# EAGLE design TPT02_tentative (EAGLE 7.7.0)
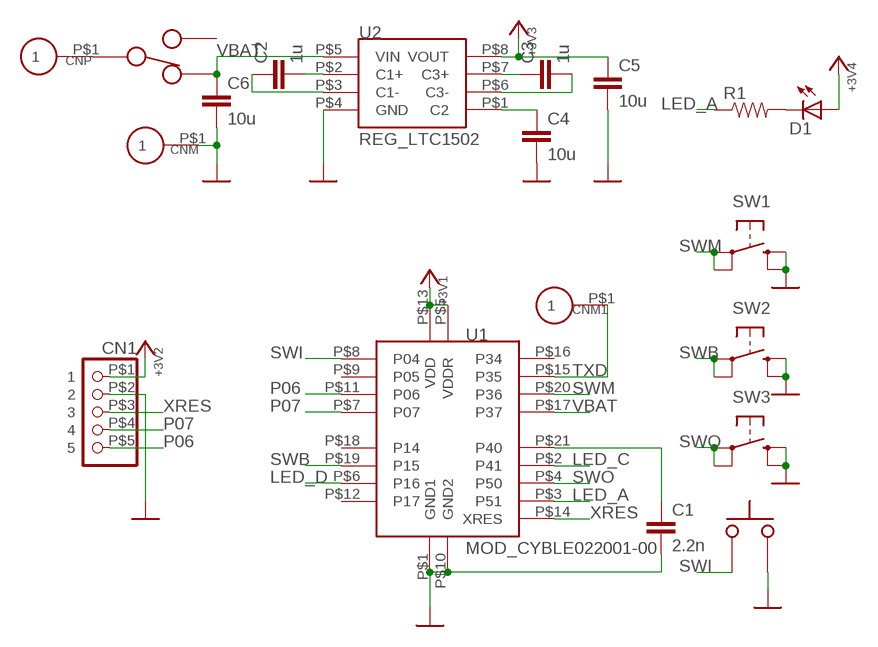
[diagram p0: schematic, sheet 1]

## Parts
C1  2.2n  CAP0603  [0603]
C2  1u  CAP0603  [0603]
C3  1u  CAP0603  [0603]
C4  10u  CAP0603  [0603]
C5  10u  CAP0603  [0603]
C6  10u  CAP0603  [0603]
CN1  CON_PINHD-1X550MIL  [1X5_50MIL]
CNM  CON_P01SMD1MM  [PAD_SMD1MM]
CNM1  CON_P01SMD1MM  [PAD_SMD1MM]
CNP  CON_P01SMD1MM  [PAD_SMD1MM]
D1  LED0603  [SPARKFUN_LED-0603]
R1  RES0603  [0603]
SW1  SW_TACTEVQP2  [SW_EVQP2]
SW2  SW_TACTTVAF17  [SW_TVF17]
SW3  SW_TACTTVAF17  [SW_TVF17]
SW4  SW_SLIDECUS12  [SW_CUS-12B]
SW6  SW_TACT2PB3U3000  [SW_B3U-3000P]
U1  MOD_CYBLE022001-00  [MOD_CYBLE022001-00]
U2  REG_LTC1502  [MSOP8]

## Nets
+3V3: C5.1 CN1.P$1 D1.A U1.P$5(VDDR) U1.P$13(VDD) U2.P$8(VOUT) ; supply symbol labelled POW_+3V3
GND: C1.2 C4.2 C5.2 C6.2 CN1.P$2 CNM.P$1 SW1.PB1(S) SW1.PB2(S1) SW2.P$3(S) SW2.P$4(S1) SW3.P$3(S) SW3.P$4(S1) SW6.P$1 U1.P$1(GND1) U1.P$10(GND2) U2.P$4(GND) ; supply symbol labelled POW_GND
LED_A: R1.1 U1.P$3(P51)
LED_C: U1.P$2(P41)
LED_D: U1.P$6(P16)
N$1: C1.1 U1.P$21(P40)
N$2: C4.1 U2.P$1(C2)
N$3: C2.2 U2.P$2(C1+)
N$4: C2.1 U2.P$3(C1-)
N$5: C3.1 U2.P$7(C3+)
N$6: C3.2 U2.P$6(C3-)
N$7: D1.C R1.2
N$8: CNP.P$1 SW4.P$2
P06: CN1.P$5 U1.P$11(P06)
P07: CN1.P$4 U1.P$7(P07)
SWB: SW2.P$1(P) SW2.P$2(P1) U1.P$19(P15)
SWI: SW6.P$2 U1.P$8(P04)
SWM: SW1.PA1(P) SW1.PA2(P1) U1.P$20(P36)
SWO: SW3.P$1(P) SW3.P$2(P1) U1.P$4(P50)
TXD: CNM1.P$1 U1.P$15(P35)
VBAT: C6.1 SW4.P$1 U1.P$17(P37) U2.P$5(VIN)
XRES: CN1.P$3 U1.P$14(XRES)
Unconnected: U1.P$9(P05) U1.P$12(P17) U1.P$16(P34) U1.P$18(P14)

## Power pins joined to a net without a drawn wire
P$3: SW4.P$3

## Library data of the parts
C1-C6 = akita:CAP: Capacitor Standard 0603 ceramic capacitor, and 0.1" leaded capacitor.
CN1 = akita:CON_PINHD-1X5: PIN HEADER
CNM CNM1 CNP = akita:CON_P01
D1 = akita:LED: LEDs Standard schematic elements and footprints for 5mm, 3mm, 1206, and 0603 sized LEDs. 5mm - Spark Fun Electronics SKU : COM-00529 (and others)
R1 = akita:RES: Resistor Basic schematic elements and footprints for 0603, 1206, and PTH resistors.
SW1-SW3 = akita:SW_TACT: OMRON SWITCH
SW4 = akita:SW_SLIDE
SW6 = akita:SW_TACT2P: OMRON SWITCH
U1 = akita:MOD_CYBLE022001-00: Cypress PRoC BLE022001-00
U2 = akita:REG_LTC1502: LinearTechnology LTC1502(-3.3), Charge-pump regulator

## Board
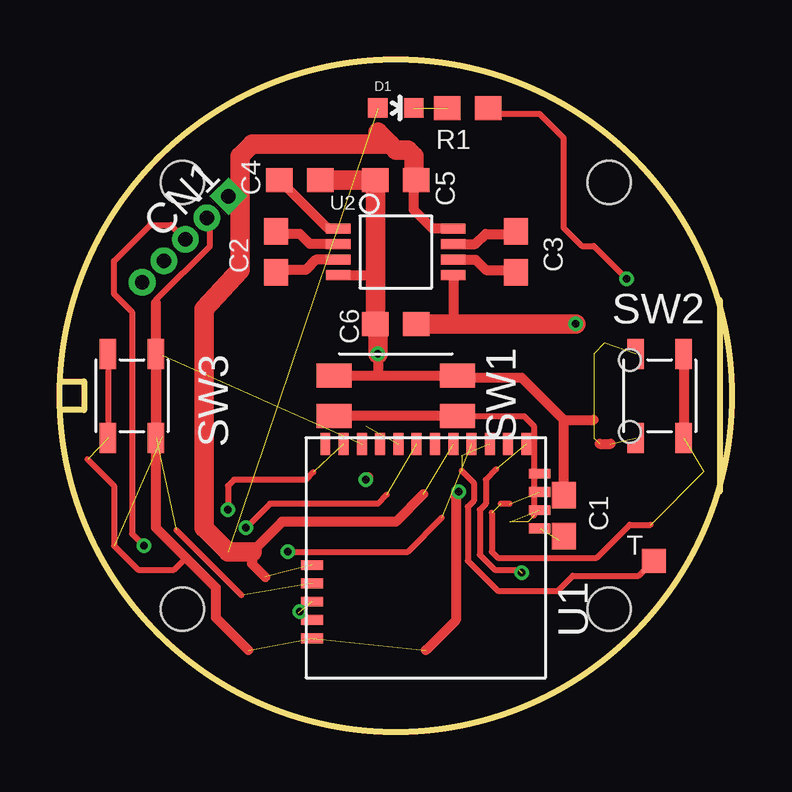
[diagram p1: board, top side]
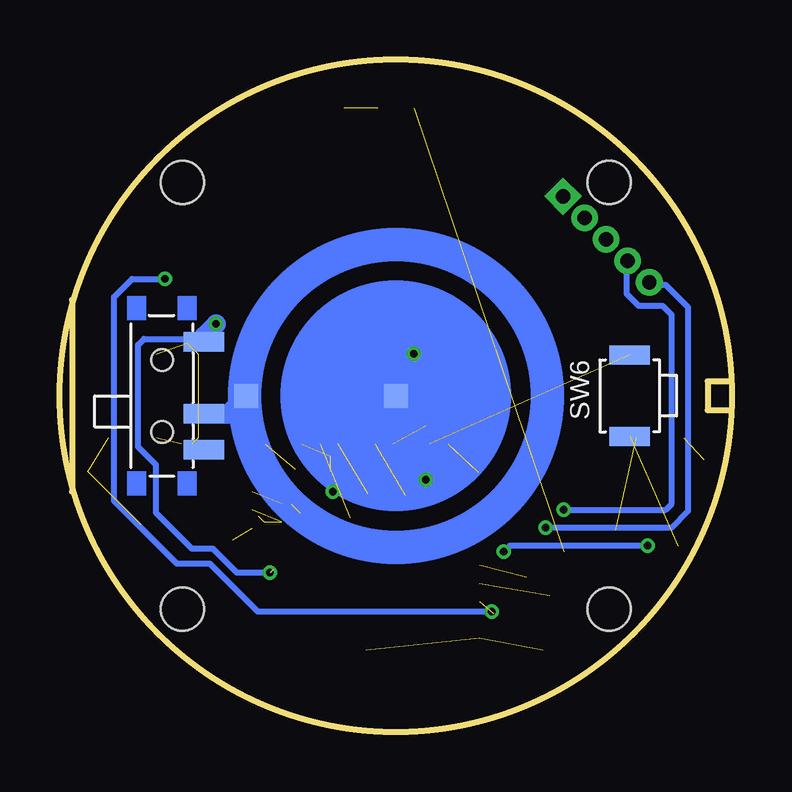
[diagram p2: board, bottom side, seen from below]

Size 28 x 28 mm. Coordinates in mm from the lower left corner, seen from the top.
Outline: 27.5,18 27.5,10
Outline: 0,14.6 1,14.6 1,13.4 0,13.4
Outline: circle at 14,14 radius 14
Copper layers (1*16): Top 0.035mm / dielectric 1.5mm / Bottom 0.035mm
Design rules "SeeedStudio_2layer_DRU_no_angle_20140221_Drill03mm": minimum track width 6mil, minimum drill 0.3mm, track to track 6mil, track to pad 6mil, pad to pad 6mil, via to via 6mil, smd to smd 0mil, copper to edge 10mil, drill to drill 10mil, minimum pad ring 10mil, minimum via ring 6mil, stop-mask expansion 2mil, vias tented up to drill 100mil, thermal gap 10mil
Holes 1.8 mm at 5.1,5.1 22.9,5.1 22.9,22.9 5.1,22.9

### Footprints (pad centres in the part's own frame; a part is rotated, then mirrored left to right if it is on the bottom)
0603 = smd 1.1 x 1: 1 -0.85,0; 2 0.85,0
1X5_50MIL = drill 0.6 square: P$1 0,2.54 | drill 0.6: P$2 0,1.27; P$3 0,0; P$4 0,-1.27; P$5 0,-2.54
PAD_SMD1MM = smd 1 x 1: P$1 0,0
SPARKFUN_LED-0603 = smd 0.8 x 0.8: A 0,-0.75; C 0,0.75
SW_EVQP2 = smd 1.45 x 1: PA1 -2.575,0.85; PA2 2.575,0.85; PB1 -2.575,-0.85; PB2 2.575,-0.85
SW_TVF17 = smd 1.25 x 0.7: P$1 -1.75,1; P$2 1.75,1; P$3 -1.75,-1; P$4 1.75,-1
SW_CUS-12B = smd 0.813 x 1.676: P$1 -2.25,1.75; P$2 0.75,1.75; P$3 2.25,1.75 | hole 0.9: -1.5,0; 1.5,0
SW_B3U-3000P = smd 0.8 x 1.7: P$1 1.7,0; P$2 -1.7,0
MOD_CYBLE022001-00 = smd 0.91 x 0.41: P$1 4.74,3.36; P$2 4.74,2.59; P$3 4.74,1.83; P$4 4.74,1.07; P$5 4.74,0.31; P$18 -4.75,-3.5; P$19 -4.75,-2.74; P$20 -4.75,-1.98; P$21 -4.75,-1.22 | smd 0.41 x 0.91: P$6 4.19,-4.74; P$7 3.43,-4.74; P$8 2.66,-4.74; P$9 1.9,-4.74; P$10 1.14,-4.74; P$11 0.38,-4.74; P$12 -0.38,-4.74; P$13 -1.15,-4.74; P$14 -1.91,-4.74; P$15 -2.67,-4.74; P$16 -3.43,-4.74; P$17 -4.19,-4.74
MSOP8 = smd 0.41 x 1.02: P$1 -0.975,-2.4; P$2 -0.325,-2.4; P$3 0.325,-2.4; P$4 0.975,-2.4; P$5 0.975,2.4; P$6 0.325,2.4; P$7 -0.325,2.4; P$8 -0.975,2.4

### Placement (x,y rotation side)
C1  21,9 90 top
C2  9,20 90 top
C3  19,20 270 top
C4  10,23 0 top
C5  14,23 180 top
C6  14,17 180 top
CN1  5.22,20.52 315 top
CNM  14,14 0 bottom
CNM1  24.75,7.12 0 top
CNP  20.25,14 0 bottom
D1  14,26 270 top
R1  17,26 180 top
SW1  14,14 180 top
SW2  25,14 270 top
SW3  3,14 270 top
SW4  23.75,14 270 bottom
SW6  4.25,14 270 bottom
U1  15.25,7.25 180 top
U2  14,20 270 top

### Tracks (layer width: path | path; a pad name or v marks a point on that pad's centre or on a via)
+3V3  (3 unrouted)
  Top 0.254: 7.5,21.88 7.46,21.88 CN1.P$1
  Top 0.406: U2.P$8 15.53,20.98 14.75,21.75 14.75,22.9 C5.1 | 15.15,9.9 14,8.75 9.25,8.75 8,7.5 8,7 8.56,6.44
  Top 0.813: 13.25,25 13.75,24.5 | 13.75,24.5 14,24.25 14.5,24.25 14.75,24 14.75,23.1 C5.1 | 13.75,24.5 8,24.5 7.5,24 7.5,21.88 7.5,19.25 6,17.62 6,8.5 7,7.5 8,7.5
GND  (via drill 0.3)  (11 unrouted)
  Top 0.254: 1.15,11.35 2.25,10.25 2.25,7.75 3.25,6.75 4.75,6.75 5.25,7.25 | SW3.P$3 SW3.P$4 | 4,17.88 4,18 6.25,20.25 6.25,21.29 CN1.P$2
  Top 0.406: U2.P$4 13.12,19.02 13.15,19 | 7.86,3.39 6.5,4.75 6.5,6 5.25,7.25 4,8.5 4,12.5 | v16.62,10 16.5,9.75 16.5,4.64 15.25,3.39 | SW1.PB2 13.25,14.85 | 13.25,14.85 SW1.PB1 16.68,14.75 19.25,14.75 21,13 | v13.25,15.75 13.25,14.85 | C1.2 21,13 | 22.5,12 22.95,12 | 21,13 22.25,13 | 12.86,10.61 v12.75,10.5 | 4,12.5 4,17.88 | 3.96,12.54 4,12.5
  Top 0.813: v13.25,15.75 13.25,16.9 C6.2 13.15,19 C5.2 C4.2
  Bottom 0.406: CNM.P$1 16.62,11.38 v16.62,10 | v12.75,10.5 12.75,12.75 CNM.P$1 | 14,15 CNM.P$1
  Bottom 0.813: 14,15 v13.25,15.75
LED_A  (via drill 0.3)  (1 unrouted)
  Top 0.254: 9.92,4.92 v10,5 | R1.1 18.1,25.75 20,25.75 21,24.75 21,21 21.75,20.25 22.25,20.25 v23.62,18.88
  Bottom 0.254: v10,5 19.75,5 21.75,7 23.12,7 25.75,9.62 25.75,18.12 25,18.88 v23.62,18.88 23.75,18.75
N$1  (1 unrouted)
  Top 0.406: 20.82,7.97 C1.1
N$2
  Top 0.406: U2.P$1 11.18,20.98 C4.1
N$3
  Top 0.406: U2.P$2 10.43,20.32 10,20.75 9.1,20.75 C2.2
N$4
  Top 0.406: U2.P$3 10.68,19.68 10.25,19.25 9.1,19.25 C2.1
N$5
  Top 0.406: U2.P$7 17.32,20.32 17.75,20.75 18.9,20.75 C3.1
N$6
  Top 0.406: U2.P$6 17.32,19.68 17.75,19.25 18.9,19.25 C3.2
N$7  (1 unrouted)
N$8
  Bottom 0.813: SW4.P$2 21,13.25 CNP.P$1
P06  (via drill 0.3)  (1 unrouted)
  Top 0.254: 13.62,9.87 13.25,9.5 8.75,9.5 v7.75,8.5
  Bottom 0.254: v7.75,8.5 2.5,8.5 1.8,9.2 1.8,17.68 2.75,18.62 3.33,18.62 CN1.P$5
P07  (via drill 0.3)  (1 unrouted)
  Top 0.254: 10.57,10.82 10.25,10.5 7.25,10.5 7,10.25 v7,9.25
  Bottom 0.254: v7,9.25 2.75,9.25 2.5,9.5 2.5,17.38 2.88,17.75 3.88,17.75 4.38,18.25 4.38,19.57 CN1.P$4
SWB  (4 unrouted)
  Top 0.254: 18,9.12 18,7.5 18.25,7.25 22.38,7.25 23.75,8.62 24.62,8.62 | 18.74,9.5 18.38,9.5
  Top 0.406: SW2.P$1 SW2.P$2
SWI  (1 unrouted)
SWM  (3 unrouted)
  Top 0.254: SW1.PA1 19.35,13.15 19.75,12.75 19.75,9
  Top 0.406: SW1.PA1 SW1.PA2
SWO  (2 unrouted)
  Top 0.254: 7.57,5.68 4.85,8.4
  Top 0.406: SW3.P$1 SW3.P$2
TXD  (3 unrouted)
  Top 0.254: 16.75,10.88 17.25,10.38 17.25,9.62 17,9.38 17,7.12 18.25,5.88 20.75,5.88 21.38,6.5 24.12,6.5 CNM1.P$1
VBAT  (via drill 0.3)  (2 unrouted)
  Top 0.254: 18.19,10.94 17.75,10.5 17.75,9.5 17.5,9.25 17.5,7.38 18.12,6.75 19.12,6.75
  Top 0.406: U2.P$5 16.4,17.15 16.25,17
  Top 0.813: v21.5,17 16.25,17 C6.1
  Bottom 0.254: v19.25,6.62 20.62,6.62 21.62,7.62 22.5,7.62 24,9.12 24,11.12 24.75,11.88 24.75,16.12 24.5,16.38 22.12,16.38 SW4.P$1 | 21.38,17.12 v21.5,17
  Bottom 0.813: SW4.P$1 22,16.5 v21.5,17
XRES  (via drill 0.3)  (1 unrouted)
  Top 0.254: v9.5,7.5 14.5,7.5 15.91,8.91 | v3.5,7.75 3,8.25 3,17.5 2.25,18.25 2.25,19.62 3.75,21.12 4.62,21.12 CN1.P$3
  Bottom 0.254: v3.5,7.75 9.25,7.75 v9.5,7.5
(copper drawn outside any net)
  shapes: Bottom circle x2

### Text on the board
tPlace: T
Document: t=0.6mm